# Altium schematic sheet MCg070V1.SchDoc
size A4
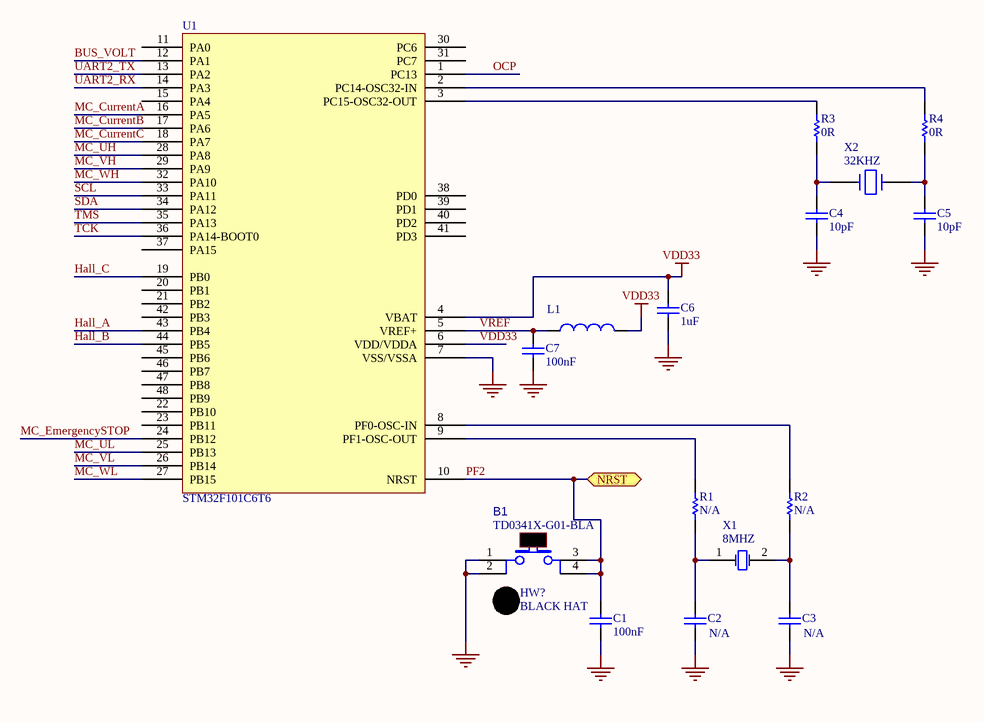
[diagram p0: MCg070V1.SchDoc]

## Parts
B1  Manufacturer_Part_Number: TD0341X-G01-BLA  [SWI_WEALTHMETAL_TD-0341_4P_BLACK]  (hidden comment: SW-PUSH-CMS_BLACK)
C1  value 100nF  [C0603]  (hidden comment: Capacitor)
C2  N/A  [C0603]
C3  N/A  [C0603]
C4  value 10pF  [C0603]  (hidden comment: Capacitor)
C5  value 10pF  [C0603]  (hidden comment: Capacitor)
C6  value 1uF  [C0603]  (hidden comment: Capacitor)
C7  value 100nF  [C0603]  (hidden comment: Capacitor)
HW?  value BLACK HAT  (hidden comment: BUTTON_HAT_BLACK)  (mechanical)
L1  BEAD  [L0603]  (value not drawn)
R1  N/A  [R0603]
R2  N/A  [R0603]
R3  value 0R  [R0603]  (hidden comment: Resistor)
R4  value 0R  [R0603]  (hidden comment: Resistor)
U1  STM32F101C6T6  [LQFP48_N]
X1  8MHZ  [CRY_NX3225GD_2P]
X2  32KHZ  [CRY_NX3215SA_2P]

## Ports
NRST

## Nets
GND: B1.1 B1.2 C1.1 C2.1 C3.1 C4.1 C5.1 C6.1 C7.1 U1.7(VSS/VSSA)
VDD33: C6.2 L1.2 U1.4(VBAT) U1.6(VDD/VDDA)
BUS_VOLT: U1.12(PA1)
Hall_A: U1.43(PB4)
Hall_B: U1.44(PB5)
Hall_C: U1.19(PB0)
MC_CurrentA: U1.16(PA5)
MC_CurrentB: U1.17(PA6)
MC_CurrentC: U1.18(PA7)
MC_EmergencySTOP: U1.24(PB12)
MC_UH: U1.28(PA8)
MC_UL: U1.25(PB13)
MC_VH: U1.29(PA9)
MC_VL: U1.26(PB14)
MC_WH: U1.32(PA10)
MC_WL: U1.27(PB15)
OCP: U1.1(PC13)
PF2: B1.3 B1.4 C1.2 U1.10(NRST) ; port NRST
SCL: U1.33(PA11)
SDA: U1.34(PA12)
TCK: U1.36(PA14-BOOT0)
TMS: U1.35(PA13)
UART2_RX: U1.14(PA3)
UART2_TX: U1.13(PA2)
VREF: C7.2 L1.1 U1.5(VREF+)
NetC2_2: C2.2 R1.2 X1.1(OSC1)
NetC3_2: C3.2 R2.2 X1.2(OSC2)
NetC4_2: C4.2 R3.2 X2.1
NetC5_2: C5.2 R4.2 X2.2
NetR1_1: R1.1 U1.9(PF1-OSC-OUT)
NetR2_1: R2.1 U1.8(PF0-OSC-IN)
NetR3_1: R3.1 U1.3(PC15-OSC32-OUT)
NetR4_1: R4.1 U1.2(PC14-OSC32-IN)

Not connected (* = marked no-connect by the designer): U1 11(PA0) 15(PA4) 20(PB1) 21(PB2) 22(PB10) 23(PB11) 30(PC6) 31(PC7) 37(PA15) 38(PD0) 39(PD1) 40(PD2) 41(PD3) 42(PB3) 45(PB6) 46(PB7) 47(PB8) 48(PB9)

## Library data of the parts
B1 = MCD-00001: Non-Open Push-Button 0.1A 24V; Part_Type: Misc; Manufacturer: WEALTHMETAL; Value: SW_BLACK; Provided_By: Subcon; Initial_Board_Reference: mb1274; Internal_Part_Number: MCD-00001; Status: Released; ComponentLink1Description: Wealthmetal_Tact-Switch_TD0341.pdf; ComponentLink1URL: http://tunmcdsvn.tun.st.com/Component_Datasheet_Library/Trunk/Misc/Wealthmetal_Tact-Switch_TD0341.pdf; Order_Code_Farnell: 535-930; ECCN_US: n/a; ECCN_EU: n/a
C1 C7 = MCD-00211: Capacitor, MLCC, 100nF, 16V, X7R, 10%, 0603, T=0,8mm; Manufacturer_Part_Number: CC0603KRX7R7BB104; Manufacturer: YAGEO; Provided_By: Subcon; Initial_Board_Reference: mb1319; Internal_Part_Number: MCD-00211; Status: Released; Part_Type: Capacitor; Package: C0603; ComponentLink1Description: Yageo_Capacitor_X7R-series.pdf; ComponentLink1URL: http://tunmcdsvn.tun.st.com/Component_Datasheet_Library/Trunk/Capacitors/Yageo_Capacitor_X7R-series.pdf; ECCN_US: n/a; ECCN_EU: n/a
C2 C3 = MCD-00637: Capacitor, MLCC, 10pF, 50V, NPO, 5%, 0603, T=0,8mm; Manufacturer_Part_Number: CC0603JRNPO9BN100; Manufacturer: YAGEO; Provided_By: subcon; Initial_Board_Reference: mb1319; Internal_Part_Number: MCD-00637; Value: 10pF; Status: Released; Part_Type: Capacitor; Package: C0603; ComponentLink1Description: Yageo_Capacitor_NP0_16V-to-50V.pdf; ComponentLink1URL: http://tunmcdsvn.tun.st.com/Component_Datasheet_Library/Trunk/Capacitors/Yageo_Capacitor_NP0_16V-to-50V.pdf; ECCN_US: n/a; ECCN_EU: n/a
C4 C5 = MCD-00666: Capacitor,5.6pF,0.1pF,16V,NPO,0603; Manufacturer_Part_Number: CC0603BRNPO7BN5R6; Manufacturer: YAGEO; Provided_By: Subcon; Initial_Board_Reference: MB1360; Internal_Part_Number: MCD-00666; Status: Footprint available; Part_Type: Capacitor; Package: C0603; ComponentLink1Description: Yageo_Capacitor_NP0_16V-to-50V.pdf; ComponentLink1URL: http://tunmcdsvn.tun.st.com/Component_Datasheet_Library/Trunk/Capacitors/Yageo_Capacitor_NP0_16V-to-50V; ECCN_US: n/a; ECCN_EU: n/a
C6 = MCD-00010: Capacitor, MLCC, 1uF, 16V, X5R, 10%, 0603, T=0,8mm; Manufacturer_Part_Number: CC0603KRX5R7BB105; Manufacturer: YAGEO; Provided_By: Subcon; Initial_Board_Reference: mb1274; Internal_Part_Number: MCD-00010; Status: Released; Part_Type: Capacitor; Package: C0603; ComponentLink1Description: Yageo_Capacitor_X5R-series.pdf; ComponentLink1URL: http://tunmcdsvn.tun.st.com/Component_Datasheet_Library/Trunk/Capacitors/Yageo_Capacitor_X5R-series.pdf; ECCN_US: n/a; ECCN_EU: n/a
HW? = MCD-00635: Black Hat for switch TD0341X-G01-BLA; Part_Type: Mechanical; Manufacturer_Part_Number: 988.16.09.3.00003_SH-517; Manufacturer: JIUBABA; Provided_By: Subcon; Initial_Board_Reference: mb1319; Internal_Part_Number: MCD-00635; Status: Released; ECCN_US: n/a; ECCN_EU: n/a; ComponentLink1Description: Juibaba_HAT_SH-517.pdf; ComponentLink1URL: http://tunmcdsvn.tun.st.com/Component_Datasheet_Library/Trunk/Mechanical/Juibaba_HAT_SH-517.pdf
L1 = MCD-00047: SMD Chip ferrite bead, 600R@100MHz +/-25%, 350mA, 500mohm DC, 0603, T=0.8mm; Manufacturer_Part_Number: FCM1608KF-601T03; Manufacturer: TAI-TECH; Part_Type: Inductor; Provided_By: Subcon; Initial_Board_Reference: mb1274; Value: 600R@100MHz; Internal_Part_Number: MCD-00047; ECCN_US: n/a; ECCN_EU: n/a; ComponentLink1Description: TaiTech_Bead_FCM1608_series.pdf; Status: Released; ComponentLink1URL: http://tunmcdsvn.tun.st.com/Component_Datasheet_Library/Trunk/Inductors/TaiTech_Bead_FCM1608_series.pdf
R1 R2 = MCD-00224: Resistor,100R,0603,1%,1/10W; Manufacturer_Part_Number: RC0603FR-07100RL; Manufacturer: YAGEO; Provided_By: Subcon; Initial_Board_Reference: mb1319; Internal_Part_Number: MCD-00224; Value: 100R; Status: Released; Part_Type: Resistor; Package: R0603; ComponentLink1Description: Yageo_Resistor_RC0603-series.pdf; ComponentLink1URL: http://tunmcdsvn.tun.st.com/Component_Datasheet_Library/Trunk/Resistors/Yageo_Resistor_RC0603-series.pdf; ECCN_US: n/a; ECCN_EU: n/a
R3 R4 = MCD-00181: Resistor,0R,0603,ULO; Manufacturer_Part_Number: PMR03EZPJ000; Manufacturer: ROHM; Provided_By: Subcon; Internal_Part_Number: MCD-00181; Status: Released; Part_Type: Resistor; Package: R0603; ComponentLink1Description: ROHM_ULtra low Ohmic Resistor _PMR10EZPJ000.pdf; ComponentLink1URL: http://tunmcdsvn.tun.st.com/Component_Datasheet_Library/Trunk/Resistors/ROHM_ULtra low Ohmic Resistor _PMR10EZPJ000.pdf; ECCN_US: n/a; ECCN_EU: n/a
U1 = STM32F101C6T6: STM32 ARM-based 32-bit MCU with 32 Kbytes Flash, 48-pin LQFP, Industrial Temperature; Published: 30-May-2008; DatasheetVersion: rev6, Mar-2008; PackageVersion: Mar-2008; PackageReference: LQFP48; Publisher: Altium Limited; PackageDescription: 48-Pin Low-Profile Quad Flat Pack, 7 x 7 mm Body, 0.5 mm Pitch (LQFP48); ComponentLink1Description: Manufacturer Link; ComponentLink1URL: www.st.com/stm32; ComponentLink2Description: Datasheet; ComponentLink2URL: http://www.st.com/stonline/products/literature/ds/13586.pdf
X1 = MCD-00092: Crystal 8Mhz, 8pF, -+50PPM, SMD; Part_Type: Crystal_Osc; Manufacturer_Part_Number: NX3225GD 8MHz EXS00A-CG04874; Manufacturer: NDK; Value: NX3225GD-8.00M; ECCN_US: EAR99; ECCN_EU: NEC; Provided_By: STM; Initial_Board_Reference: mb1274; Internal_Part_Number: MCD-00092; Status: Released; ComponentLink1Description: NDK_Crystal-For-ST_NX3225GD 8MHz EXS00A-CG04874 (EXS10B-20725).pdf; ComponentLink1URL: http://tunmcdsvn.tun.st.com/Component_Datasheet_Library/Trunk/Crystal_Osc/NDK_Crystal-For-ST_NX3225GD 8MHz EXS00A-CG04874 (EXS10B-20725).pdf
X2 = MCD-00091: Crystal 32.768kHz, 6pF, -+20PPM, R=50K, SMD; Part_Type: Crystal_Osc; Manufacturer_Part_Number: NX3215SA 32.768KHz EXS00A-MU00525; Manufacturer: NDK; Value: NX3215SA-32.768K; ECCN_US: EAR99; ECCN_EU: NEC; Provided_By: STM; Initial_Board_Reference: mb1274; Internal_Part_Number: MCD-00091; Status: Released; ComponentLink1Description: NDK_Crystal-For-ST_NX3215SA 32.768KHz EXS00A-MU00525 (EXS10B-21238).pdf; ComponentLink1URL: http://tunmcdsvn.tun.st.com/Component_Datasheet_Library/Trunk/Crystal_Osc/NDK_Crystal-For-ST_NX3215SA 32.768KHz EXS00A-MU00525 (EXS10B-21238).pdf